# Altium schematic sheet RGB_LED.SchDoc
size A; SheetNumber: 7; SheetTotal: 16
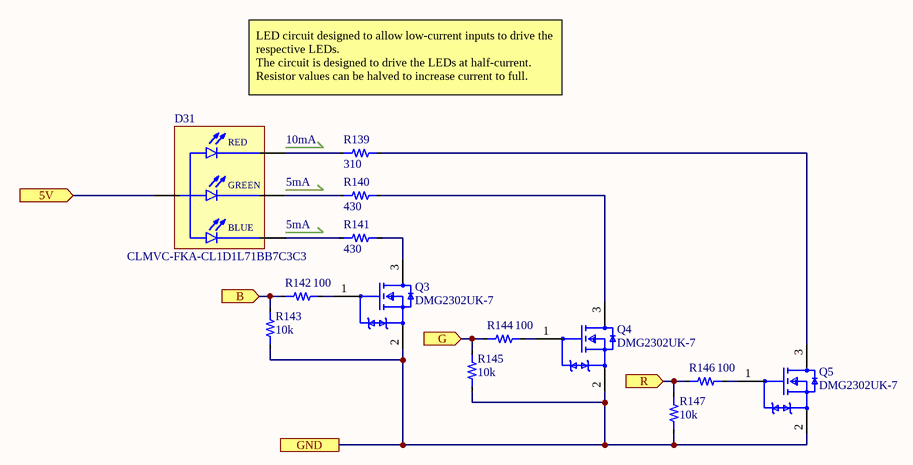
[diagram p0: RGB_LED.SchDoc]

## Parts
D31  CLMVC-FKA-CL1D1L71BB7C3C3  [4PLCC CreeLED]
Q3  DMG2302UK-7  [SOT23-3]
Q4  DMG2302UK-7  [SOT23-3]
Q5  DMG2302UK-7  [SOT23-3]
R139  value 310  [0603_RES]  (hidden comment: Resistor)
R140  value 430  [0603_RES]  (hidden comment: Resistor)
R141  value 430  [0603_RES]  (hidden comment: Resistor)
R142  value 100  [0603_RES]  (hidden comment: Resistor)
R143  value 10k  [0603_RES]  (hidden comment: Resistor)
R144  value 100  [0603_RES]  (hidden comment: Resistor)
R145  value 10k  [0603_RES]  (hidden comment: Resistor)
R146  value 100  [0603_RES]  (hidden comment: Resistor)
R147  value 10k  [0603_RES]  (hidden comment: Resistor)

## Ports
5V (in), B (in), G (in), GND, R (in)

## Nets
5V: D31.1(A) ; port 5V
B: R142.1 R143.2 ; port B
G: R144.1 R145.2 ; port G
GND: Q3.2(S) Q4.2(S) Q5.2(S) R143.1 R145.1 R147.1 ; port GND
R: R146.1 R147.2 ; port R
NetD31_2: D31.2(B_C) R141.1
NetD31_3: D31.3(G_C) R140.1
NetD31_4: D31.4(R_C) R139.1
NetQ3_1: Q3.1(G) R142.2
NetQ3_3: Q3.3(D) R141.2
NetQ4_1: Q4.1(G) R144.2
NetQ4_3: Q4.3(D) R140.2
NetQ5_1: Q5.1(G) R146.2
NetQ5_3: Q5.3(D) R139.2

## Notes on the sheet
- LED circuit designed to allow low-current inputs to drive the respective LEDs.
  The circuit is designed to drive the LEDs at half-current.
  Resistor values can be halved to increase current to full.
- 10mA
- 5mA
- (in symbol CLMVC-FKA-CL1D1L71BB7C3C3) RED; GREEN; BLUE

## Library data of the parts
D31 = CLMVC-FKA-CL1D1L71BB7C3C3: Red, Green, Blue (RGB) 622nm Red, 530nm Green, 470nm Blue LED Indication - Discrete 2V Red, 3V Green, 3V Blue 4-SMD, J-Lead; MF: Cree Inc.; SnapEDA_Link: https://www.snapeda.com/parts/CLMVC-FKA-CL1D1L71BB7C3C3/Cree+Inc./view-part/?ref=snap; Package: SMD-4 Cree Inc.; Value: *; MP: CLMVC-FKA-CL1D1L71BB7C3C3; Check_prices: https://www.snapeda.com/parts/CLMVC-FKA-CL1D1L71BB7C3C3/Cree+Inc./view-part/?ref=eda
Q3-Q5 = DMG2302UK-7: MOSFET N-CH 20V 2.8A SOT23; Manufacturer: Diodes Inc.; Reverse Recovery Time: 5.3ns; Gate Charge At Vgs: 2.8nC @ 10V; Turn On Delay Time: 0.6ns; Pulse Drain Current: 12A; Max Forward Diode Voltage: 1.2V; Reverse Recovery Charge: 0.5nC; Automotive Grade: Grade 0; Threshold Vgs Min: 0.3V; Number Of N Channels: 1; Standoff Height: 0.013mm; Typ Forward Diode Voltage: 0.7V; Drain To Source Resistance: 61mΩ; Rthja Max: 192°C/W; Max Junction Temp: +150°C; Input Capacitace At Vds: 130pF @ 10V; Threshold Vgs Max: 1V; Turn Off Delay Time: 4.2ns; Depletion Mode: False; Gate To Source Voltage: 12V; Power Dissipation: 0.66W; Device Class L1: Discrete Semiconductors; Footprint Url: https://www.diodes.com/assets/Package-Files/SOT23.pdf; Lead Free: Yes; Manufacturer Part Number: DMG2302UK-7; Temperature Range High: +150°C; Drain To Source Voltage: 20V; Category: Trans; Digikey Description: MOSFET N-CH 20V 2.8A SOT23; RoHS: TRUE; Device Class L2: Transistors; Height: 1.1mm; Automotive: Yes; Package: SOT23; Drain To Source Breakdown Voltage: 20V; Continuous Drain Current: 2.8A; ComponentLink2Description: Datasheet; Device Class L3: MOSFETs; Octopart: https://octopart.com/dmg2302uk-7-diodes+inc.-73850182; Temperature Range Low: -55°C; Temperature: -55°C to +150°C; Number Of Channels: 1; ComponentLink2URL: https://www.diodes.com/assets/Datasheets/DMG2302UK.pdf
R139-R147 = Resistor: Tolerance: *